# Altium schematic sheet Power.SchDoc
size A; SheetNumber: 3; SheetTotal: 4
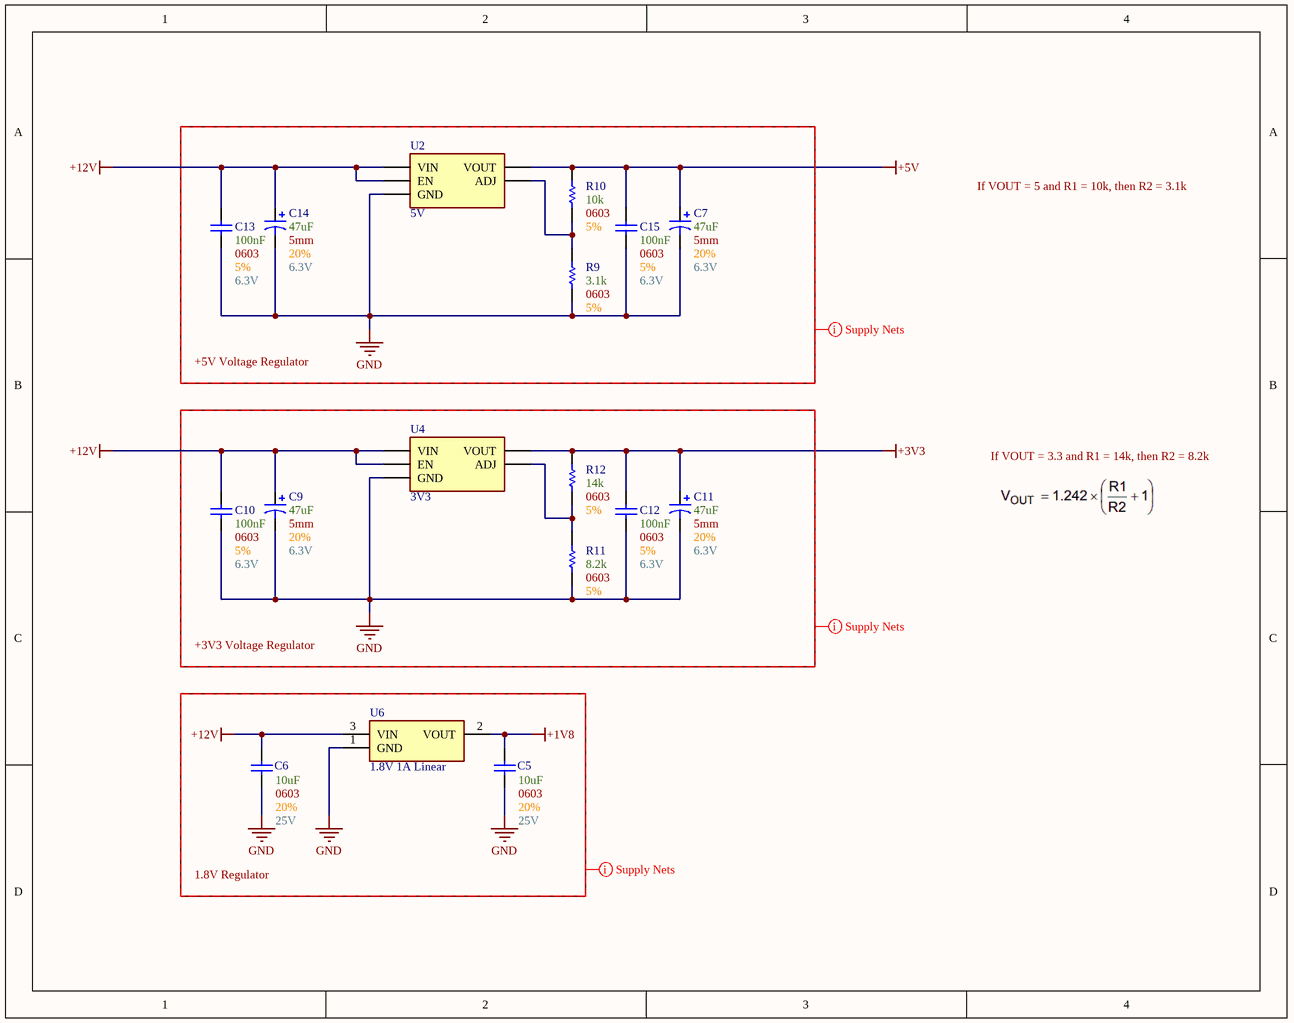
[diagram p0: Power.SchDoc]

## Parts
C5  Voltage: 25V  Tolerance: 20%  Size Package: 0603  Capacitance: 10uF  [[Cap] SMD 0603]  (hidden comment: SMD Nonpolarized)
C6  Voltage: 25V  Tolerance: 20%  Size Package: 0603  Capacitance: 10uF  [[Cap] SMD 0603]  (hidden comment: SMD Nonpolarized)
C7  Capacitance: 47uF  Diameter: 5mm  Tolerance: 20%  Max Voltage: 6.3V  [[Cap] SMD Polarized, 5mm]  (hidden comment: SMD Polarized)
C9  Capacitance: 47uF  Diameter: 5mm  Tolerance: 20%  Max Voltage: 6.3V  [[Cap] SMD Polarized, 5mm]  (hidden comment: SMD Polarized)
C10  Size Package: 0603  Capacitance: 100nF  Voltage: 6.3V  Tolerance: 5%  [[Cap] SMD 0603]  (hidden comment: [Cap] SMD Nonpolarized)
C11  Capacitance: 47uF  Diameter: 5mm  Tolerance: 20%  Max Voltage: 6.3V  [[Cap] SMD Polarized, 5mm]  (hidden comment: SMD Polarized)
C12  Size Package: 0603  Capacitance: 100nF  Voltage: 6.3V  Tolerance: 5%  [[Cap] SMD 0603]  (hidden comment: [Cap] SMD Nonpolarized)
C13  Size Package: 0603  Capacitance: 100nF  Voltage: 6.3V  Tolerance: 5%  [[Cap] SMD 0603]  (hidden comment: [Cap] SMD Nonpolarized)
C14  Capacitance: 47uF  Diameter: 5mm  Tolerance: 20%  Max Voltage: 6.3V  [[Cap] SMD Polarized, 5mm]  (hidden comment: SMD Polarized)
C15  Size Package: 0603  Capacitance: 100nF  Voltage: 6.3V  Tolerance: 5%  [[Cap] SMD 0603]  (hidden comment: [Cap] SMD Nonpolarized)
R9  Tolerance: 5%  Resistance: 3.1k  Size Package: 0603  [[Res] SMD 0603]  (hidden comment: [Res] SMD Resistor)
R10  Tolerance: 5%  Resistance: 10k  Size Package: 0603  [[Res] SMD 0603]  (hidden comment: [Res] SMD Resistor)
R11  Tolerance: 5%  Resistance: 8.2k  Size Package: 0603  [[Res] SMD 0603]  (hidden comment: [Res] SMD Resistor)
R12  Tolerance: 5%  Resistance: 14k  Size Package: 0603  [[Res] SMD 0603]  (hidden comment: [Res] SMD Resistor)
U2  5V  [[Reg] Variable Voltage Regulator]
U4  3V3  [[Reg] Variable Voltage Regulator]
U6  1.8V 1A Linear  [[Reg] 1.8V Regulator]

## Blocks framed on the sheet
+5V Voltage Regulator: C7 C13-C15 R9 R10 U2
+3V3 Voltage Regulator: C9-C12 R11 R12 U4
1.8V Regulator: C5 C6 U6

## Nets
+1V8: C5.2 U6.2(VOUT)
+3V3: C11.1 C12.2 R12.2 U4.4(VOUT)
+5V: C7.1 C15.2 R10.2 U2.4(VOUT)
+12V: C6.2 C9.1 C10.2 C13.2 C14.1 U2.1(EN) U2.2(VIN) U4.1(EN) U4.2(VIN) U6.3(VIN)
GND: C5.1 C6.1 C7.2 C9.2 C10.1 C11.2 C12.1 C13.1 C14.2 C15.1 R9.1 R11.1 U2.3(GND) U4.3(GND) U6.1(GND)
NetR9_2: R9.2 R10.1 U2.5(ADJ)
NetR11_2: R11.2 R12.1 U4.5(ADJ)

## Layout directives
net class Supply_Nets: +1V8, +12V, GND

## Notes on the sheet
- If VOUT = 5 and R1 = 10k, then R2 = 3.1k
- If VOUT = 3.3 and R1 = 14k, then R2 = 8.2k

## Library data of the parts
C5 C6 = [Cap] SMD Nonpolarized: Supplier 1: DigiKey; Supplier Part Number 1: 1276-1869-1-ND
C7 C9 C11 C14 = [Cap] SMD Polarized: Supplier 1: DigiKey; Supplier Part Number 1: 493-2152-1-ND
R9-R12 = [Res] SMD Resistor: Generic; Supplier 1: DigiKey
  R9: Supplier Part Number 1: 311-3.16KHRCT-ND
  R10: Supplier Part Number 1: 311-10.0KHRDKR-ND
  R11: Supplier Part Number 1: 311-8.2KGRCT-ND
  R12: Supplier Part Number 1: RMCF0603FT14K0DKR-ND
U2 U4 = [Reg] Variable Voltage Regulator: MIC29302WT; Supplier 1: DigiKey; Supplier Part Number 1: 576-1124-ND
U6 = [Reg] 1.8V Regulator: NCP1117IST18T3G; Supplier 1: DigiKey; Supplier Part Number 1: 488-NCP1117IST18T3GCT-ND
C10 C12 C13 C15 = [Cap] SMD Nonpolarized: Supplier 1: DigiKey; Supplier Part Number 1: 311-1088-6-ND